# Altium schematic sheet TF-USB.SchDoc
size A3; SheetNumber: 9; SheetTotal: 10
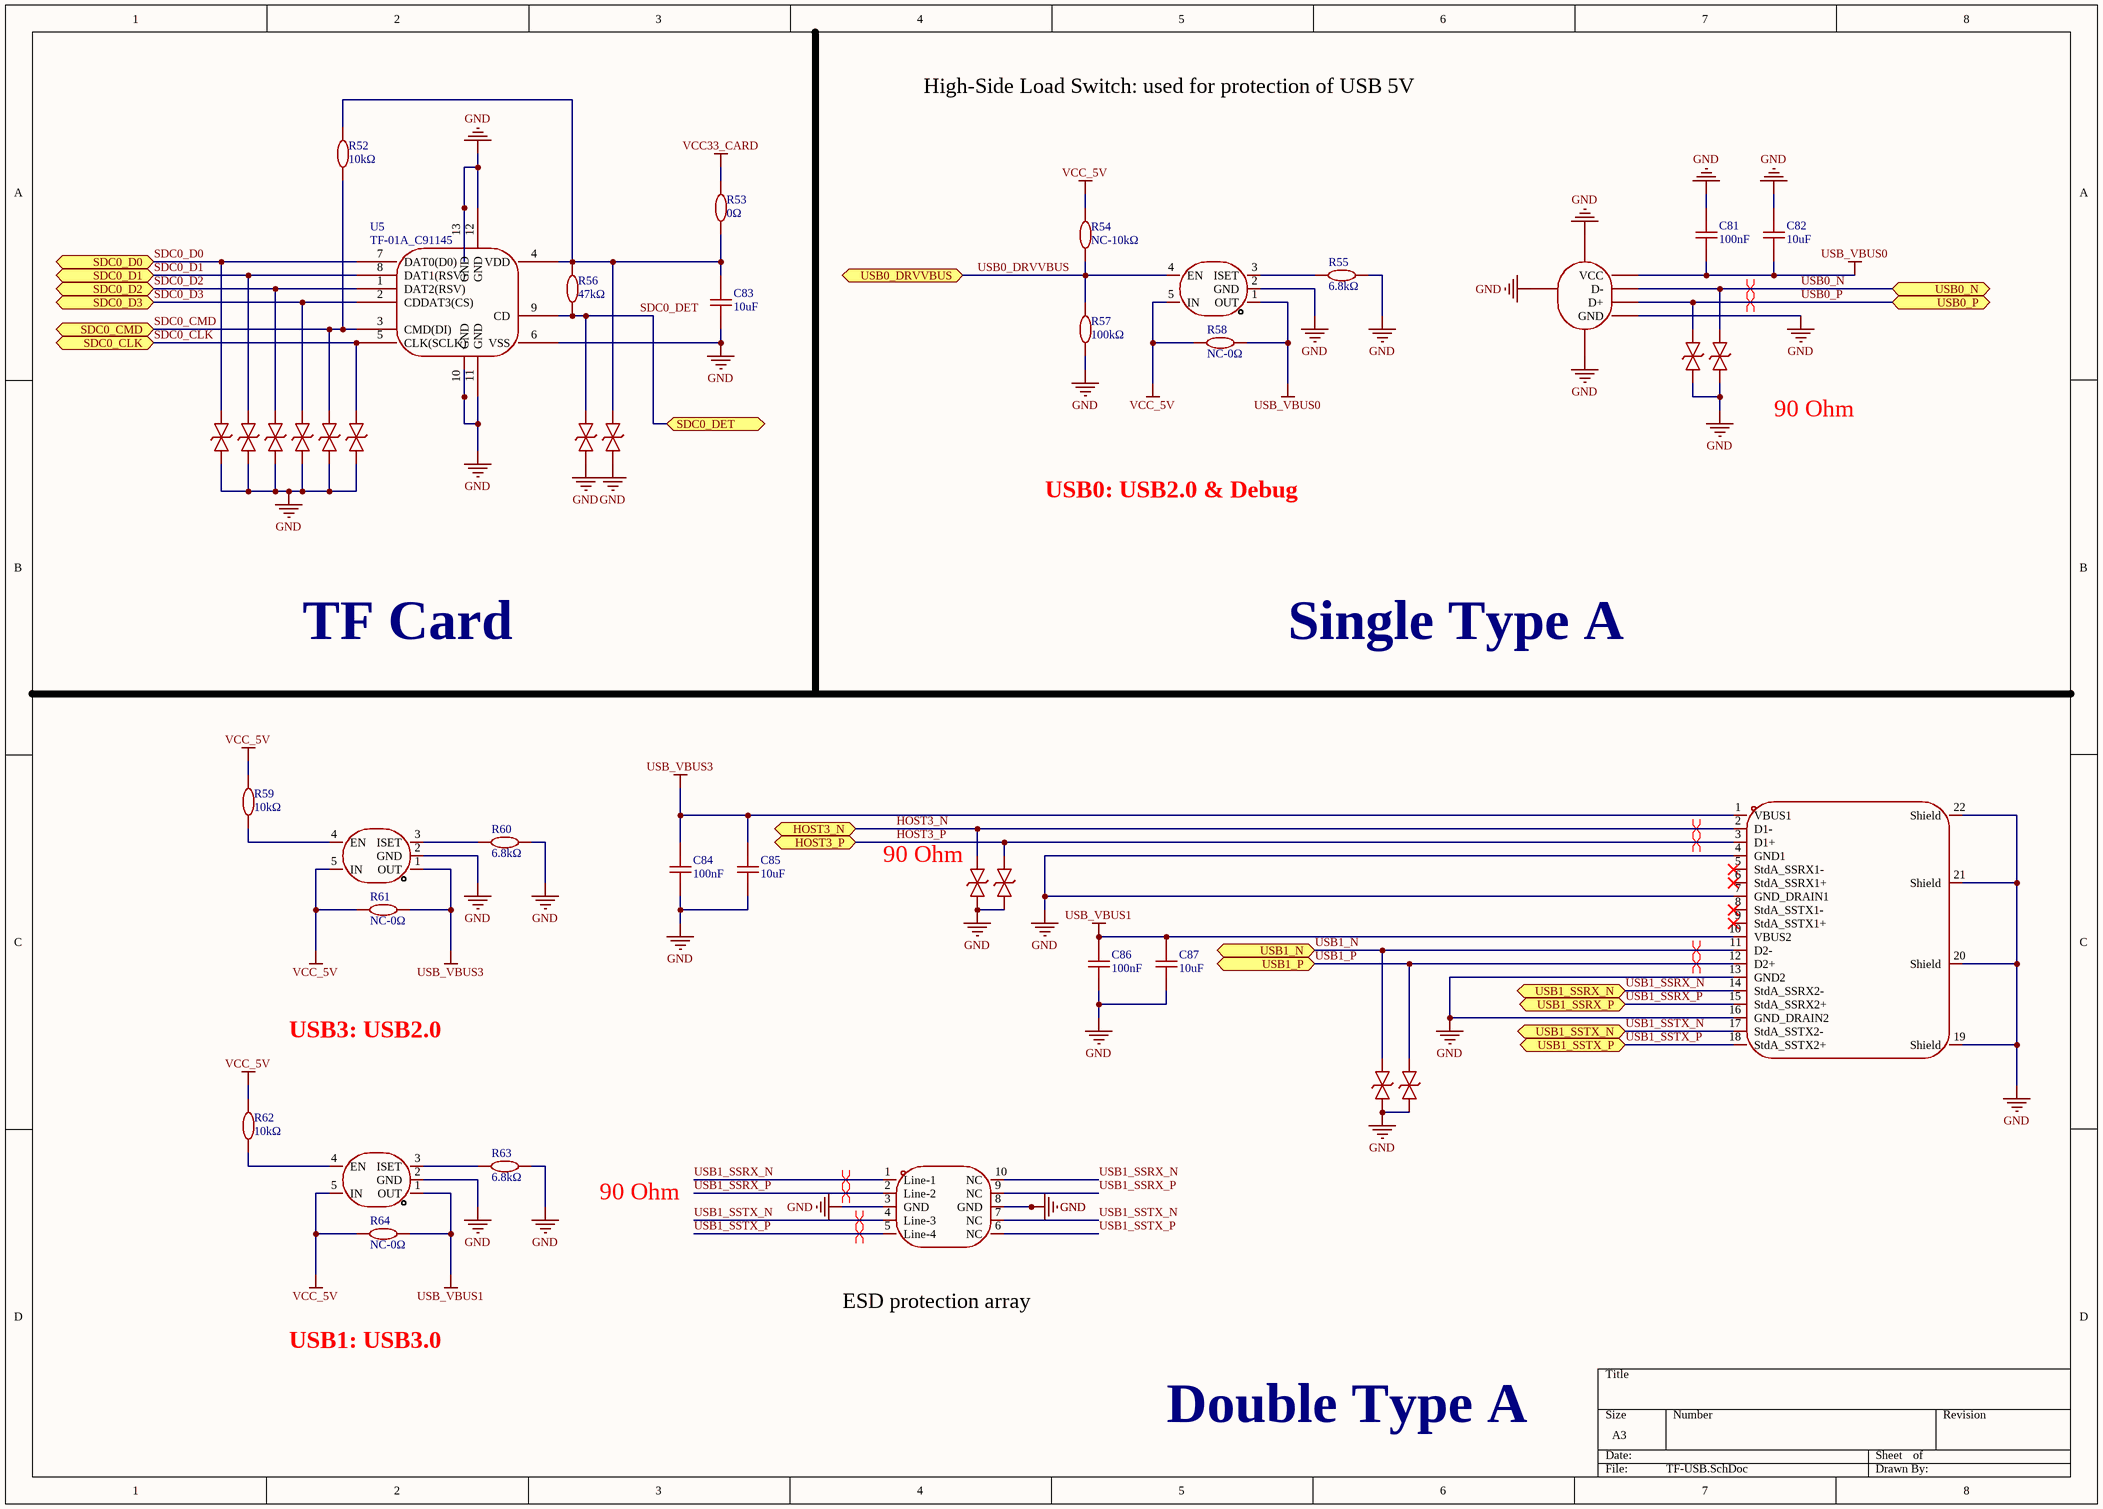
[diagram p0: TF-USB.SchDoc]

## Parts
C81  100nF  [C0402]
C82  10uF  [C0603]
C83  10uF  [C0603]
C84  100nF  [C0402]
C85  10uF  [C0603]
C86  100nF  [C0402]
C87  10uF  [C0603]
D6  AZ1045-04F.R7G  [DFN2510-10_L2.5-W1.0-P0.50-BL]  (value not drawn)
R52  10kΩ  [R0402]
R53  0Ω  [R0402]
R54  NC-10kΩ  [R0402]
R55  6.8kΩ  [R0402]
R56  47kΩ  [R0402]
R57  100kΩ  [R0402]
R58  NC-0Ω  [R0402]
R59  10kΩ  [R0402]
R60  6.8kΩ  [R0402]
R61  NC-0Ω  [R0402]
R62  10kΩ  [R0402]
R63  6.8kΩ  [R0402]
R64  NC-0Ω  [R0402]
U5  TF-01A_C91145  [TF-SMD_TF-01A]
U13  SY6280AAC  [SOT-23-5_L3.0-W1.7-P0.95-LS2.8-BL]  (value not drawn)
U14  ESD5451N  [DFN1006-2L-BI]  (value not drawn)
U15  ESD5451N  [DFN1006-2L-BI]  (value not drawn)
U16  ESD5451N  [DFN1006-2L-BI]  (value not drawn)
U17  ESD5451N  [DFN1006-2L-BI]  (value not drawn)
U18  ESD5451N  [DFN1006-2L-BI]  (value not drawn)
U19  ESD5451N  [DFN1006-2L-BI]  (value not drawn)
U20  ESD5451N  [DFN1006-2L-BI]  (value not drawn)
U21  ESD5451N  [DFN1006-2L-BI]  (value not drawn)
U22  ESD5451N  [DFN1006-2L-BI]  (value not drawn)
U23  ESD5451N  [DFN1006-2L-BI]  (value not drawn)
U24  ESD5451N  [DFN1006-2L-BI]  (value not drawn)
U25  ESD5451N  [DFN1006-2L-BI]  (value not drawn)
U26  SY6280AAC  [SOT-23-5_L3.0-W1.7-P0.95-LS2.8-BL]  (value not drawn)
U27  ESD5451N  [DFN1006-2L-BI]  (value not drawn)
U28  ESD5451N  [DFN1006-2L-BI]  (value not drawn)
U29  SY6280AAC  [SOT-23-5_L3.0-W1.7-P0.95-LS2.8-BL]  (value not drawn)
USB1  USB-303WSD-BRY  [USB-A-TH_XUNPU_USB-303WSD-BRY]  (value not drawn)
USB2  906-162A1011D10200  [USB-A-TH_4P-P1.40-V-F-C39416]  (value not drawn)

## Ports
HOST3_N (bidir, see SoC_2[2A]), HOST3_P (bidir, see SoC_2[2A]), SDC0_CLK (bidir, see SoC_1[7A]), SDC0_CMD (bidir, see SoC_1[6A]), SDC0_D0 (bidir, see SoC_1[6A]), SDC0_D1 (bidir, see SoC_1[6A]), SDC0_D2 (bidir, see SoC_1[6A]), SDC0_D3 (bidir, see SoC_1[6A]), SDC0_DET (bidir, see SoC_1[6A]), USB0_DRVVBUS (bidir, see SoC_1[6C]), USB0_N (bidir, see SoC_2[2A]), USB0_P (bidir, see SoC_2[2A]), USB1_N (bidir, see SoC_2[2A]), USB1_P (bidir, see SoC_2[2A]), USB1_SSRX_N (bidir, see SoC_2[2A]), USB1_SSRX_P (bidir, see SoC_2[2A]), USB1_SSTX_N (bidir, see SoC_2[1A]), USB1_SSTX_P (bidir, see SoC_2[1A])

## Nets
GND: C81.2 C82.2 C83.1 C84.1 C85.1 C86.1 C87.1 D6.3(GND) D6.8(GND) R55.2 R57.1 R60.2 R63.2 U5.6(VSS) U5.10(GND) U5.11(GND) U5.12(GND) U5.13(GND) U13.2(GND) U14.1 U15.1 U16.1 U17.1 U18.1 U19.1 U20.1 U21.1 U22.1 U23.1 U24.1 U25.1 U26.2(GND) U27.1 U28.1 U29.2(GND) USB1.4(GND1) USB1.7(GND_DRAIN1) USB1.13(GND2) USB1.16(GND_DRAIN2) USB1.19(Shield) USB1.20(Shield) USB1.21(Shield) USB1.22(Shield) USB2.4(GND) USB2.5 USB2.6 USB2.7
USB_VBUS0: C81.1 C82.1 R58.1 U13.1(OUT) USB2.1(VCC)
USB_VBUS1: C86.2 C87.2 R64.1 U29.1(OUT) USB1.10(VBUS2)
USB_VBUS3: C84.2 C85.2 R61.1 U26.1(OUT) USB1.1(VBUS1)
VCC33_CARD: R53.2
VCC_5V: R54.2 R58.2 R59.2 R61.2 R62.2 R64.2 U13.5(IN) U26.5(IN) U29.5(IN)
HOST3_N: U24.2 USB1.2(D1-) ; port HOST3_N
HOST3_P: U25.2 USB1.3(D1+) ; port HOST3_P
SDC0_CLK: U5.5(CLK(SCLK)) U21.2 ; port SDC0_CLK
SDC0_CMD: R52.1 U5.3(CMD(DI)) U20.2 ; port SDC0_CMD
SDC0_D0: U5.7(DAT0(D0)) U16.2 ; port SDC0_D0
SDC0_D1: U5.8(DAT1(RSV)) U17.2 ; port SDC0_D1
SDC0_D2: U5.1(DAT2(RSV)) U18.2 ; port SDC0_D2
SDC0_D3: U5.2(CDDAT3(CS)) U19.2 ; port SDC0_D3
SDC0_DET: R56.1 U5.9(CD) U22.2 ; port SDC0_DET
USB0_DRVVBUS: R54.1 R57.2 U13.4(EN) ; port USB0_DRVVBUS
USB0_N: U15.2 USB2.2(D-) ; port USB0_N
USB0_P: U14.2 USB2.3(D+) ; port USB0_P
USB1_N: U27.2 USB1.11(D2-) ; port USB1_N
USB1_P: U28.2 USB1.12(D2+) ; port USB1_P
USB1_SSRX_N: D6.1(Line-1) D6.10(NC) USB1.14(StdA_SSRX2-) ; port USB1_SSRX_N
USB1_SSRX_P: D6.2(Line-2) D6.9(NC) USB1.15(StdA_SSRX2+) ; port USB1_SSRX_P
USB1_SSTX_N: D6.4(Line-3) D6.7(NC) USB1.17(StdA_SSTX2-) ; port USB1_SSTX_N
USB1_SSTX_P: D6.5(Line-4) D6.6(NC) USB1.18(StdA_SSTX2+) ; port USB1_SSTX_P
NetC83_2: C83.2 R52.2 R53.1 R56.2 U5.4(VDD) U23.2
NetR55_1: R55.1 U13.3(ISET)
NetR59_1: R59.1 U26.4(EN)
NetR60_1: R60.1 U26.3(ISET)
NetR62_1: R62.1 U29.4(EN)
NetR63_1: R63.1 U29.3(ISET)

Not connected (* = marked no-connect by the designer): USB1 5(StdA_SSRX1-)* 6(StdA_SSRX1+)* 8(StdA_SSTX1-)* 9(StdA_SSTX1+)*

## Layout directives
differential pair: HOST3_N, HOST3_P, USB0_N, USB0_P, USB1_N, USB1_P, USB1_SSRX_N, USB1_SSRX_P, USB1_SSTX_N, USB1_SSTX_P

## Notes on the sheet
- High-Side Load Switch: used for protection of USB 5V
- 90 Ohm
- USB0: USB2.0 & Debug
- TF Card
- Single Type A
- (near U24) 90 Ohm
- USB3: USB2.0
- ESD protection array
- USB1: USB3.0
- Double Type A

## Library data of the parts
C81 C84 C86 = 100nF: 50V 100nF X7R ±10% 0402 Ceramic Capacitors ROHS
C82 C83 C85 C87 = 10uF: 10V 10uF X5R ±10% 0603 Ceramic Capacitors ROHS
D6 = AZ1045-04F.R7G: 3.5A@8/20us 30W@8/20us 12V 6V 5V DFN2510-10 TVS Diodes ROHS; Manufacturer: AMAZING(晶焱); Add into BOM: yes; Reverse Leakage Current (Ir): 1.5uA; Number of Channels: 4; level of protection: IEC 61000-4-5；IEC 61000-4-2; Type: ESD; Junction Capacitance: 0.5pF; Symbol: AZ1045-04F.R7G; Device: AZ1045-04F.R7G; LCSC Part Name: ESD 5V截止 峰值脉冲电流：3.5A@8/20us; Supplier Part: C356811; Manufacturer Part: AZ1045-04F.R7G; Supplier Footprint: DFN2510-10; JLCPCB Part Class: Extended Part; Datasheet: https://item.szlcsc.com/datasheet/AZ1045-04F.R7G/331915.html; Supplier: LCSC; Convert to PCB: yes; Reverse Stand-Off Voltage (Vrwm): 5V; Clamping Voltage: 12V; Peak Pulse Current (Ipp): 3.5A@8/20us; Peak Pulse Power Dissipation (Ppp): 30W@8/20us; Voltage - Breakdown: 6V
R52 R54 R59 R62 = 10kΩ: 62.5mW 10kΩ 50V ±100ppm/℃ Thick Film Resistor ±1% 0402 Chip Resistor - Surface Mount ROHS
R53 R58 R61 R64 = 0Ω: 0Ω 62.5mW 50V Thick Film Resistor ±1% 0402 Chip Resistor - Surface Mount ROHS
R55 R60 R63 = 6.8kΩ: 62.5mW 6.8kΩ 50V ±100ppm/℃ Thick Film Resistor ±1% 0402 Chip Resistor - Surface Mount ROHS
R56 = 47kΩ: 62.5mW 47kΩ 50V ±100ppm/℃ Thick Film Resistor ±1% 0402 Chip Resistor - Surface Mount ROHS
R57 = 100kΩ: 100kΩ 62.5mW 50V ±100ppm/℃ Thick Film Resistor ±1% 0402 Chip Resistor - Surface Mount ROHS
U5 = TF-01A_C91145: Push-Push 1.85mm Connector and Ejector MicroSD Card (TF Card) SMD PC Card Sockets ROHS
U13 U26 U29 = SY6280AAC_C55136: 1 Active High High Side Switch SOT-23-5 Power Distribution Switches, Load Drivers ROHS; Manufacturer: Silergy(矽力杰); Add into BOM: yes; Number of Channels: 1; Voltage - Supply: 2.4V~5.5V; RDS(on): 80mΩ; Symbol: SY6280AAC; Device: SY6280AAC_C55136; LCSC Part Name: SY6280AAC; Supplier Part: C55136; Manufacturer Part: SY6280AAC; Supplier Footprint: SOT-23-5; JLCPCB Part Class: Extended Part; Datasheet: https://item.szlcsc.com/datasheet/SY6280AAC/56162.html; Supplier: LCSC; Convert to PCB: yes; Type: High Side Switch; Control Input Logic: Active High; Operating Temperature	-: -40℃~+125℃; Features: Over Temperature Protection；Overcurrent Protection(OCP)
U14-U25 U27 U28 = ESD5451N_C5261080: 9A 9.8V 8V Bidirectional 5V DFN1006-2L TVS Diodes ROHS; Manufacturer: HXY MOSFET(华轩阳电子); Add into BOM: yes; Reverse Leakage Current (Ir): 500nA; Number of Channels: 1.0; level of protection: IEC 61000-4-2; Junction Capacitance: 15pF; Symbol: ESD5451N_C5261080; Device: ESD5451N_C5261080; LCSC Part Name: 5V 15pF 双向; Supplier Part: C5261080; Manufacturer Part: ESD5451N; Supplier Footprint: DFN1006-2L; JLCPCB Part Class: Extended Part; Datasheet: https://item.szlcsc.com/datasheet/ESD5451N/5983779.html; Supplier: LCSC; Convert to PCB: yes; Polarity: Bidirectional; Reverse Stand-Off Voltage (Vrwm): 5V; Clamping Voltage: 9.8V; Peak Pulse Current (Ipp): 9A; Voltage - Breakdown: 8V; Type: ESD
USB1 = USB-303WSD-BRY: USB 3.0 2 9Px2 -30℃~+85℃ Type-A Through Hole,Right Angle USB, DVI, HDMI Connector Assemblies ROHS; Manufacturer: XUNPU(讯普); Add into BOM: yes; Protocol Standard: USB 3.0; Gender: Female; Number of Ports: 2; Current Rating-Power: 1.8A; Voltage Rating: 30V; Detection color: Blue; Symbol: USB-303WSD-BRY; Device: USB-303WSD-BRY; Supplier Part: C2895028; Manufacturer Part: USB-303WSD-BRY; Supplier Footprint: 插件; JLCPCB Part Class: Extended Part; Datasheet: https://item.szlcsc.com/datasheet/USB-303WSD-BRY/3132965.html; Supplier: LCSC; Convert to PCB: yes; Connector Type: Type-A; Mounting Type: Right Angle; Number of Contacts: 9Px2; Length: -; Operating Temperature: -30℃~+85℃; LCSC Part Name: Type-A 母 弯插
USB2 = 906-162A1011D10200: USB 2.0 1 4P Type-A Through Hole USB, DVI, HDMI Connector Assemblies ROHS; Manufacturer: 精拓金; Symbol: AFSide of the three straight feet boundless copper14.0PBTWhite plastic90degree; Add into BOM: yes; Protocol Standard: USB 2.0; Gender: Female; Number of Ports: 1; Current Rating-Power: 2A; Device: 906-162A1011D10200; LCSC Part Name: Type-A 母 侧插; Supplier Part: C39417; Manufacturer Part: 906-162A1011D10200; Supplier Footprint: 插件; JLCPCB Part Class: Extended Part; Datasheet: https://item.szlcsc.com/datasheet/906-162A1011D10200/40400.html; Supplier: LCSC; Convert to PCB: yes; Connector Type: Type-A; Mounting Type: Vertical, Flag; Number of Contacts: 4P; Operating Temperature: -